# Altium schematic sheet Power_Switch.SchDoc: Ixora
size A3; Organization: Toradex AG; Address1: Altsagenstrasse 5; Address2: Horw; Address3: 6048; Address4: Switzerland; DocumentNumber: 4; Revision: V1.1; SheetNumber: 6; SheetTotal: 17; PageSetup: Record=PageOptions|CenterHorizontal=True|CenterVertical=True|PrintScale=0.71|XCorrection=1.00|YCorrection=1.00|PrintKind=0|BorderSize=5000000|LeftOffset=0|BottomOffset=0|Orientation=2|PaperLength=1000|PaperWidth=1000|Scale=100|PaperSource=7|PrintQuality=-4|MediaType=1|DitherType=10|PaperKind=A4|PrintScaleMode=1
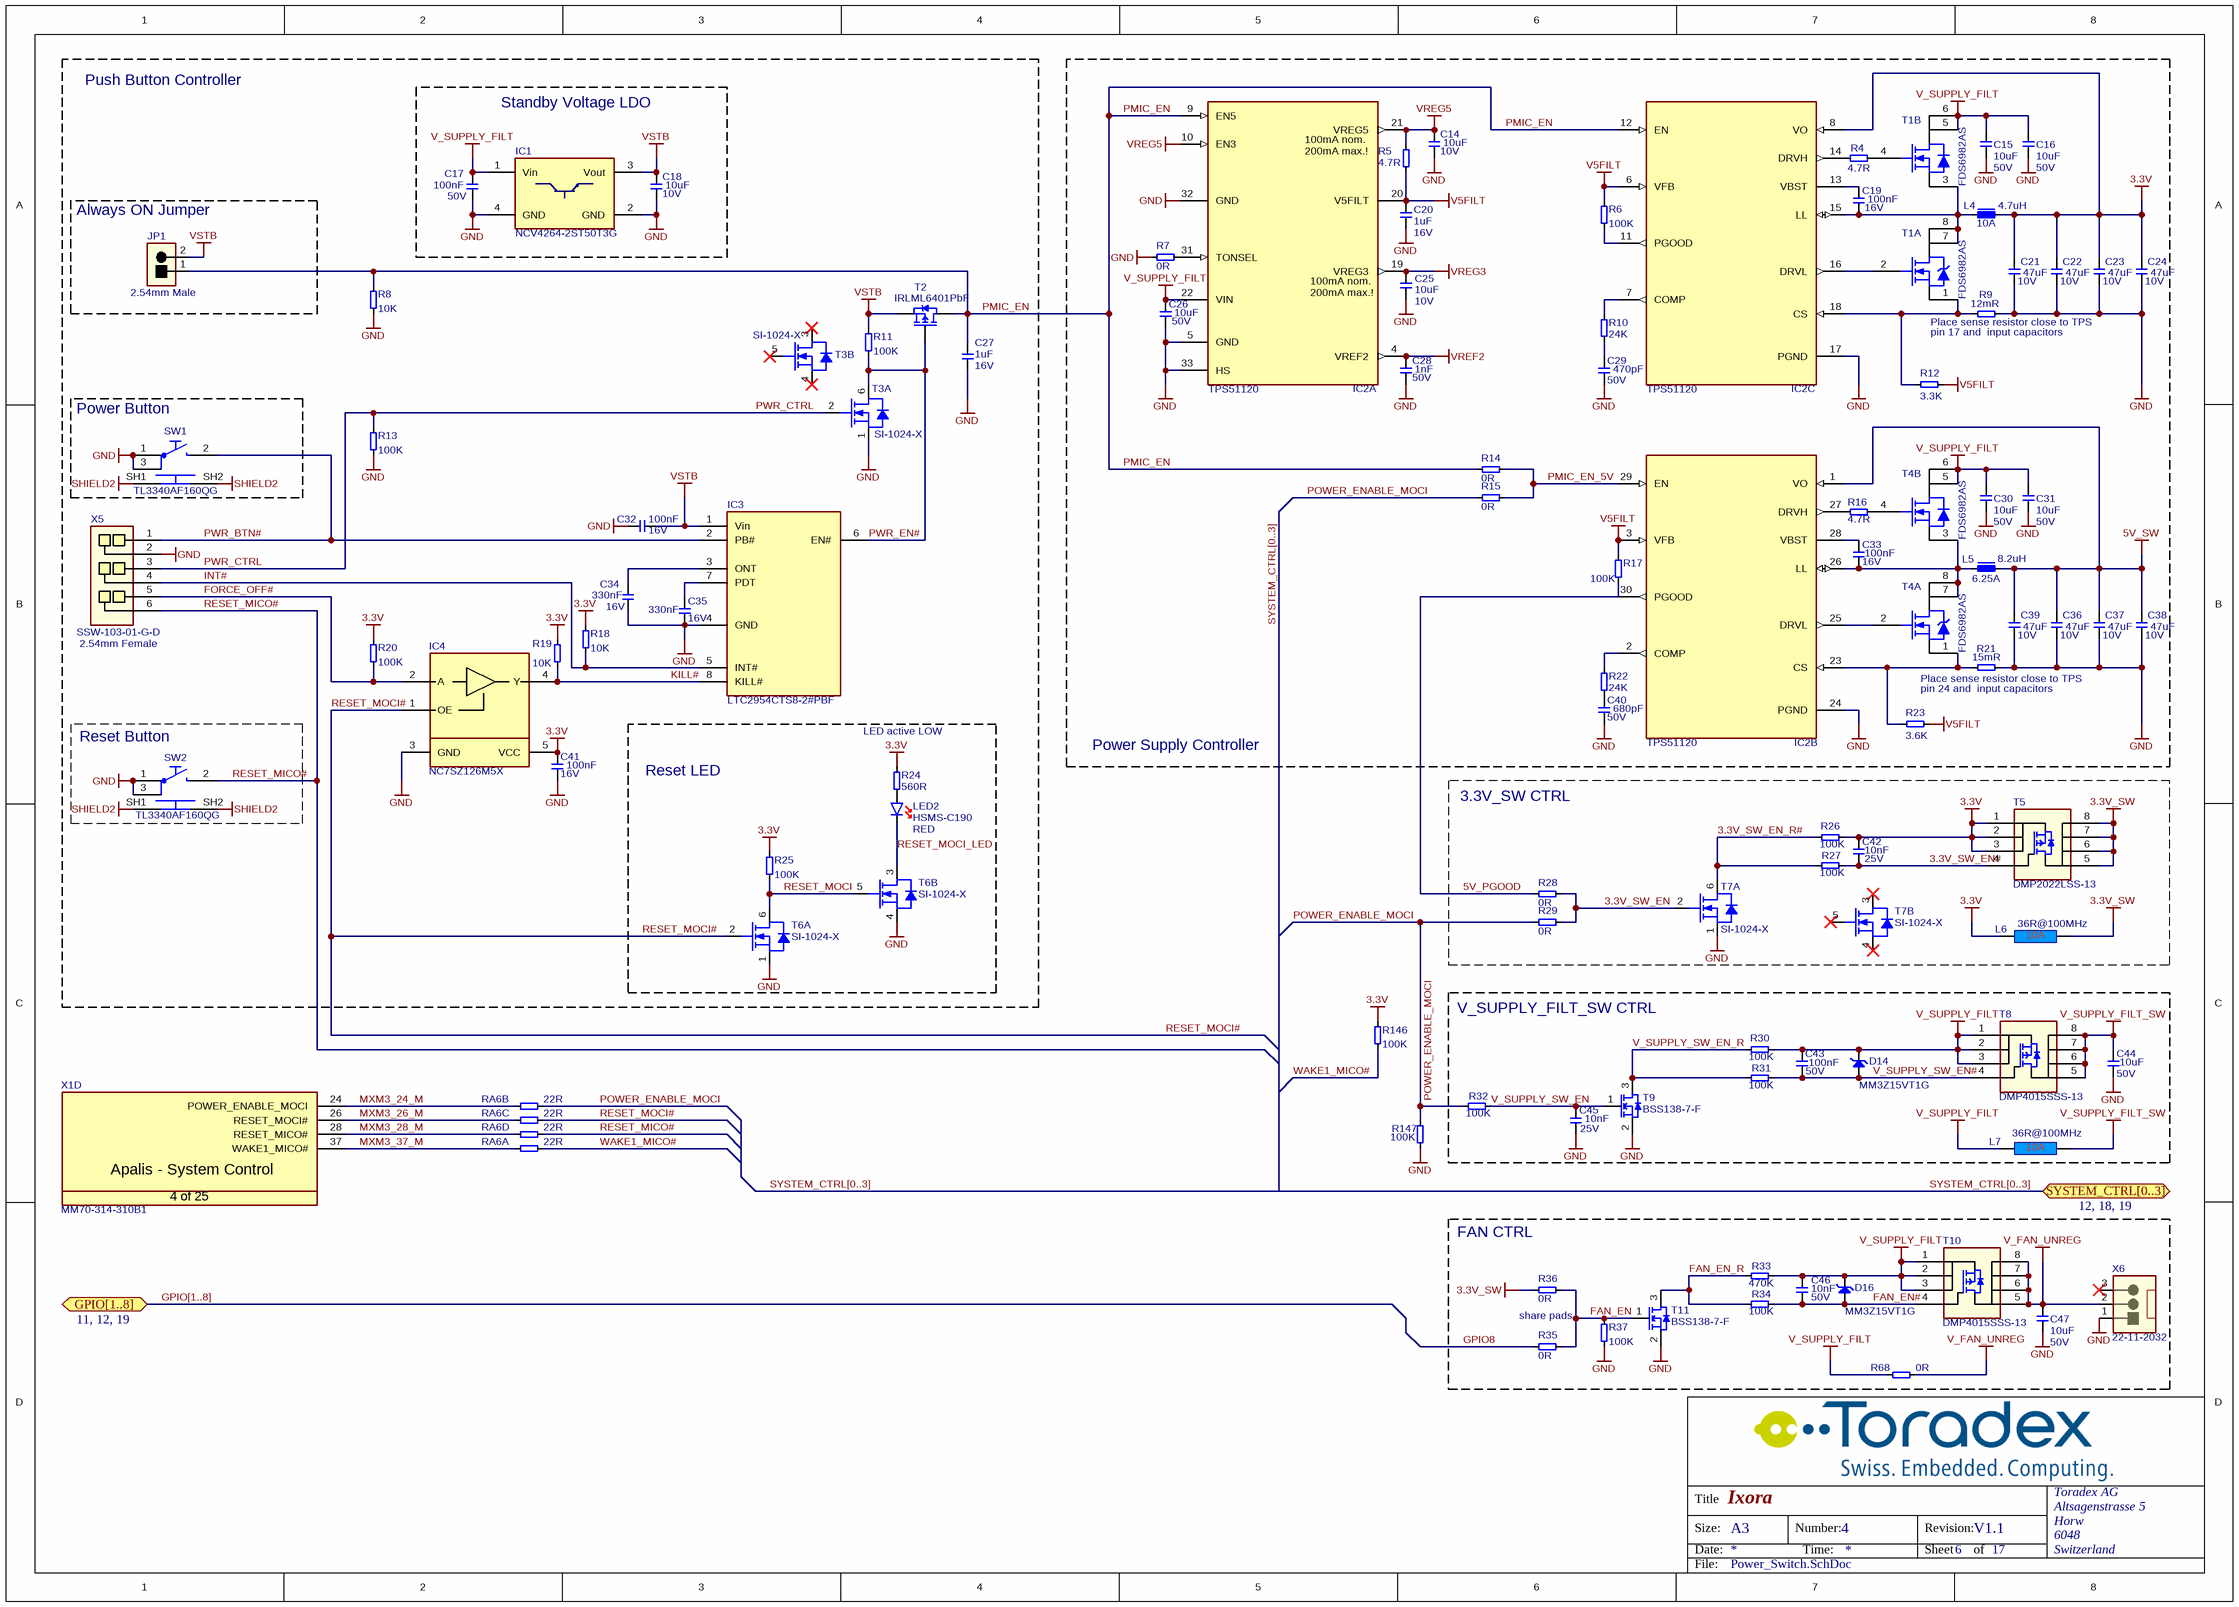
[diagram p0: Power_Switch.SchDoc]

## Parts
C14  Rating: 10V  [T_CAPC0603X33N]  (hidden comment: 10uF)
C15  Rating: 50V  [CAPC3225X160N]  (hidden comment: 10uF)
C16  Rating: 50V  [CAPC3225X160N]  (hidden comment: 10uF)
C17  Rating: 50V  [T_CAPC0603X33N]  (hidden comment: 100nF)
C18  Rating: 10V  [T_CAPC0603X33N]  (hidden comment: 10uF)
C19  Rating: 16V  [CAPC1005X60N]  (hidden comment: 100nF)
C20  Rating: 16V  [T_CAPC0603X33N]  (hidden comment: 1uF)
C21  Rating: 10V  [T_CAPC0805X125N]  (hidden comment: 47uF)
C22  Rating: 10V  [T_CAPC0805X125N]  (hidden comment: 47uF)
C23  Rating: 10V  [T_CAPC0805X125N]  (hidden comment: 47uF)
C24  Rating: 10V  [T_CAPC0805X125N]  (hidden comment: 47uF)
C25  Rating: 10V  [T_CAPC0603X33N]  (hidden comment: 10uF)
C26  Rating: 50V  [CAPC3225X160N]  (hidden comment: 10uF)
C27  Rating: 16V  [T_CAPC0603X33N]  (hidden comment: 1uF)
C28  Rating: 50V  [CAPC1005X60N]  (hidden comment: 1nF)
C29  Rating: 50V  [CAPC1005X60N]  (hidden comment: 470pF)
C30  Rating: 50V  [CAPC3225X160N]  (hidden comment: 10uF)
C31  Rating: 50V  [CAPC3225X160N]  (hidden comment: 10uF)
C32  Rating: 16V  [CAPC1005X60N]  (hidden comment: 100nF)
C33  Rating: 16V  [CAPC1005X60N]  (hidden comment: 100nF)
C34  Rating: 16V  [T_CAPC0805X125N]  (hidden comment: 330nF)
C35  Rating: 16V  [T_CAPC0805X125N]  (hidden comment: 330nF)
C36  Rating: 10V  [T_CAPC0805X125N]  (hidden comment: 47uF)
C37  Rating: 10V  [T_CAPC0805X125N]  (hidden comment: 47uF)
C38  Rating: 10V  [T_CAPC0805X125N]  (hidden comment: 47uF)
C39  Rating: 10V  [T_CAPC0805X125N]  (hidden comment: 47uF)
C40  Rating: 50V  [CAPC1005X60N]  (hidden comment: 680pF)
C41  Rating: 16V  [CAPC1005X60N]  (hidden comment: 100nF)
C42  Rating: 25V  [CAPC1005X60N]  (hidden comment: 10nF)
C43  Rating: 50V  [T_CAPC0603X33N]  (hidden comment: 100nF)
C44  Rating: 50V  [CAPC3225X160N]  (hidden comment: 10uF)
C45  Rating: 25V  [CAPC1005X60N]  (hidden comment: 10nF)
C46  Rating: 50V  [CAPC1005X60N]  (hidden comment: 10nF)
C47  Rating: 50V  [CAPC3225X160N]  (hidden comment: 10uF)
D14  MM3Z15VT1G  [T_SOD-323]
D16  MM3Z15VT1G  [T_SOD-323]
IC1  NCV4264-2ST50T3G  [T_ON_NCV4264-2ST50T3G]
IC2  TPS51120  [QFN50P500X500X100-33N]  (parts A,B,C of 3)
IC3  LTC2954CTS8-2#PBF  [T_LINEAR_LTC2954CTS8-2#PBF]
IC4  NC7SZ126M5X  [SOT95P279X142-5N]
JP1  TSW-101-07-G-D  [T_Samtec_TSW-101-07-G-D]  (value not drawn)
L4  Rating: 10A  [T_INDM110100]  (hidden comment: 4.7uH)
L5  Rating: 6.25A  [T_INDM120120X80N]  (hidden comment: 8.2uH)
L6  36R@100MHz  [T_Laird_35F0121-0SR-10]
L7  36R@100MHz  [T_Laird_35F0121-0SR-10]
LED2  Manufacturer Part No.: HSMS-C190  Color: RED  [LEDC1608X80N_R]  (hidden comment: LED)
R4  4.7R  [RESC1005X40N]
R5  4.7R  [RESC1005X40N]
R6  100K  [RESC1005X40N]
R7  0R  [RESC1005X40N]
R8  10K  [RESC1005X40N]
R9  12mR  [RESC3316X76N]
R10  24K  [RESC1005X40N]
R11  100K  [RESC1005X40N]
R12  3.3K  [RESC1005X40N]
R13  100K  [RESC1005X40N]
R14  0R  [T_RESC0603X30N]
R15  0R  [T_RESC0603X30N]
R16  4.7R  [RESC1005X40N]
R17  100K  [RESC1005X40N]
R18  10K  [RESC1005X40N]
R19  10K  [RESC1005X40N]
R20  100K  [RESC1005X40N]
R21  15mR  [RESC3316X76N]
R22  24K  [RESC1005X40N]
R23  3.6K  [RESC1005X40N]
R24  560R  [RESC1005X40N]
R25  100K  [RESC1005X40N]
R26  100K  [RESC1005X40N]
R27  100K  [RESC1005X40N]
R28  0R  [T_RESC0603X30N]
R29  0R  [T_RESC0603X30N]
R30  100K  [RESC1005X40N]
R31  100K  [RESC1005X40N]
R32  100K  [RESC1005X40N]
R33  470K  [RESC1005X40N]
R34  100K  [RESC1005X40N]
R35  0R  [T_RESC0603X30N]
R36  0R  [T_RESC0603X30N]
R37  100K  [RESC1005X40N]
R68  0R  [T_RESC3225X30N]
R146  100K  [RESC1005X40N]
R147  100K  [RESC1005X40N]
RA6  22R  [T_Resistor_Array_X4]  (parts A,B,C,D of 4)
SW1  TL3340AF160QG  [T_E-SWITCH- TL3340AF160QG]
SW2  TL3340AF160QG  [T_E-SWITCH- TL3340AF160QG]
T1  FDS6982AS  [SOIC127P600X173-8N]  (parts A,B of 2)
T2  IRLML6401PbF  [SOT95P237X112-3N]
T3  Manufacturer Part No.: SI-1024-X  [SOTFL50P160X60-6N]  (hidden comment: T-Vishay-SI-1024X-N)  (parts A,B of 2)
T4  FDS6982AS  [SOIC127P600X173-8N]  (parts A,B of 2)
T5  DMP2022LSS-13  [SOIC127P600X173-8N]
T6  Manufacturer Part No.: SI-1024-X  [SOTFL50P160X60-6N]  (hidden comment: T-Vishay-SI-1024X-N)  (parts A,B of 2)
T7  Manufacturer Part No.: SI-1024-X  [SOTFL50P160X60-6N]  (hidden comment: T-Vishay-SI-1024X-N)  (parts A,B of 2)
T8  DMP4015SSS-13  [SOIC127P600X173-8N]
T9  BSS138-7-F  [SOT95P237X112-3N]
T10  DMP4015SSS-13  [SOIC127P600X173-8N]
T11  BSS138-7-F  [SOT95P237X112-3N]
X1  Manufacturer Part No.: MM70-314-310B1  [T_JAE_MM70-314-310B1]  (hidden comment: CON-JAE-MM70-314-310B1-314-0.5mm)  (part D of 25)
X5  Manufacturer Part No.: SSW-103-01-G-D  [T_Samtec_SSW-103-01-G-D]  (hidden comment: TSW-103-01-G-D)
X6  22-11-2032  [T_MOLEX_22-11-2032]

## Blocks framed on the sheet
Push Button Controller: C27 C32 C34 C35 C41 IC3 IC4 R8 R11 R13 R18-R20 T2 T3 X5
Power Supply Controller: C14-C16 C19-C26 C28-C31 C33 C36-C40 IC2 L4 L5 R4-R7 R9 R10 R12 R14-R17 R21-R23 T1 T4
Standby Voltage LDO: C17 C18 IC1
Always ON Jumper: JP1
Power Button: SW1
Reset Button: SW2
Reset LED: LED2 R24 R25 T6
3.3V_SW CTRL: C42 L6 R26-R29 T5 T7
V_SUPPLY_FILT_SW CTRL: C43-C45 D14 L7 R30-R32 T8 T9
FAN CTRL: C46 C47 D16 R33-R37 R68 T10 T11 X6

## Ports
GPIO[1..8] (bidir, see 11, 12, 19), SYSTEM_CTRL[0..3] (bidir, see 12, 18, 19)

## Nets
3.3V: C21.2 C22.2 C23.2 C24.2 C41.1 C42.2 IC2.8(VO) IC4.5(VCC) L4.2 L6.1 R18.1 R19.1 R20.2 R24.1 R25.2 R26.1 R146.2 T5.1(S) T5.2(S) T5.3(S)
3.3V_SW: L6.2 R36.1 T5.5(D) T5.6(D) T5.7(D) T5.8(D)
5V_SW: C36.2 C37.2 C38.2 C39.2 IC2.1(VO) L5.2
GND: C14.1 C15.1 C16.1 C17.1 C18.1 C20.1 C21.1 C22.1 C23.1 C24.1 C25.1 C26.1 C27.1 C28.1 C29.1 C30.1 C31.1 C32.1 C34.1 C35.1 C36.1 C37.1 C38.1 C39.1 C40.1 C41.2 C44.1 C45.1 C47.1 IC1.2(GND) IC1.4(GND) IC2.5(GND) IC2.17(PGND) IC2.24(PGND) IC2.32(GND) IC2.33(HS) IC3.4(GND) IC4.3(GND) R7.1 R8.1 R9.2 R13.1 R21.2 R37.2 R147.1 SW1.1 SW1.3 SW2.1 SW2.3 T3.1(S) T6.1(S) T6.4(S) T7.1(S) T9.2 T11.2 X5.2 X6.1
SHIELD2: SW1.SH1 SW1.SH2 SW2.SH1 SW2.SH2
V5FILT: C20.2 IC2.3(VFB) IC2.6(VFB) IC2.20(V5FILT) R5.1 R6.2 R12.2 R17.2 R23.2
V_FAN_UNREG: C47.2 R68.2 T10.5(D) T10.6(D) T10.7(D) T10.8(D) X6.2
V_SUPPLY_FILT: C15.2 C16.2 C17.2 C26.2 C30.2 C31.2 C43.2 C46.2 D14.1(C) D16.1(C) IC1.1(Vin) IC2.22(VIN) L7.1 R30.2 R33.2 R68.1 T1.5(D) T1.6(D) T4.5(D) T4.6(D) T8.1(S) T8.2(S) T8.3(S) T10.1(S) T10.2(S) T10.3(S)
V_SUPPLY_FILT_SW: C44.2 L7.2 T8.5(D) T8.6(D) T8.7(D) T8.8(D)
VREF2: C28.2 IC2.4(VREF2)
VREG3: C25.2 IC2.19(VREG3)
VREG5: C14.2 IC2.10(EN3) IC2.21(VREG5) R5.2
VSTB: C18.2 C32.2 IC1.3(Vout) IC3.1(Vin) JP1.2 R11.2 T2.2
3.3V_SW_EN: R28.1 R29.2 T7.2(G)
3.3V_SW_EN#: C42.1 R27.1 T5.4(G)
3.3V_SW_EN_R#: R26.2 R27.2 T7.6(D)
5V_PGOOD: IC2.30(PGOOD) R17.1 R28.2
FAN_EN: R35.1 R36.2 R37.1 T11.1
FAN_EN#: C46.1 D16.2(A) R34.2 T10.4(G)
FAN_EN_R: R33.1 R34.1 T11.3
FORCE_OFF#: IC4.2(A) R20.1 X5.5
GPIO8: R35.2
INT#: IC3.5(INT#) R18.2 X5.4
KILL#: IC3.8(KILL#) IC4.4(Y) R19.2
MXM3_24_M: RA6.2 X1.24(POWER_ENABLE_MOCI)
MXM3_26_M: RA6.3 X1.26(RESET_MOCI#)
MXM3_28_M: RA6.4 X1.28(RESET_MICO#)
MXM3_37_M: RA6.1 X1.37(WAKE1_MICO#)
PMIC_EN: C27.2 IC2.9(EN5) IC2.12(EN) JP1.1 R8.2 R14.1 T2.3
PMIC_EN_5V: IC2.29(EN) R14.2 R15.2
POWER_ENABLE_MOCI: R15.1 R29.1 R32.1 R147.2 RA6.6
PWR_BTN#: IC3.2(PB#) SW1.2 X5.1
PWR_CTRL: R13.2 T3.2(G) X5.3
PWR_EN#: IC3.6(EN#) R11.1 T2.1 T3.6(D)
RESET_MICO#: RA6.8 SW2.2 X5.6
RESET_MOCI: R25.1 T6.5(G) T6.6(D)
RESET_MOCI#: IC4.1(OE) RA6.7 T6.2(G)
RESET_MOCI_LED: LED2.1(K) T6.3(D)
V_SUPPLY_SW_EN: C45.2 R32.2 T9.1
V_SUPPLY_SW_EN#: C43.1 D14.2(A) R31.2 T8.4(G)
V_SUPPLY_SW_EN_R: R30.1 R31.1 T9.3
WAKE1_MICO#: R146.1 RA6.5
NetC19_1: C19.1 IC2.15(LL) L4.1 T1.3(S) T1.7(D) T1.8(D)
NetC19_2: C19.2 IC2.13(VBST)
NetC29_2: C29.2 R10.1
NetC33_1: C33.1 IC2.26(LL) L5.1 T4.3(S) T4.7(D) T4.8(D)
NetC33_2: C33.2 IC2.28(VBST)
NetC34_2: C34.2 IC3.3(ONT)
NetC35_2: C35.2 IC3.7(PDT)
NetC40_2: C40.2 R22.1
NetIC2_2: IC2.2(COMP) R22.2
NetIC2_7: IC2.7(COMP) R10.2
NetIC2_11: IC2.11(PGOOD) R6.1
NetIC2_14: IC2.14(DRVH) R4.1
NetIC2_16: IC2.16(DRVL) T1.2(G)
NetIC2_18: IC2.18(CS) R9.1 R12.1 T1.1(S)
NetIC2_23: IC2.23(CS) R21.1 R23.1 T4.1(S)
NetIC2_25: IC2.25(DRVL) T4.2(G)
NetIC2_27: IC2.27(DRVH) R16.1
NetIC2_31: IC2.31(TONSEL) R7.2
NetLED2_2: LED2.2(A) R24.2
NetR4_2: R4.2 T1.4(G)
NetR16_2: R16.2 T4.4(G)

Not connected (* = marked no-connect by the designer): T3 3(D)* 4(S)* 5(G)*; T7 3(D)* 4(S)* 5(G)*; X6 3*

## Buses and harness runs
bus GPIO[1..8] = port GPIO[1..8]
bus SYSTEM_CTRL[0..3] = port SYSTEM_CTRL[0..3]

## Notes on the sheet
- (near JP1) 2.54mm Male
- (near R9) Place sense resistor close to TPS
- (near R9) pin 17 and  input capacitors
- (near X5) 2.54mm Female
- (near R21) Place sense resistor close to TPS
- pin 24 and  input capacitors
- LED active LOW
- share pads
- Title
- Size:
- Date:
- A3
- Number:
- Time:
- Revision:
- Sheet
- of
- File:
- (in symbol CON-JAE-MM70-314-310B1-314-0.5mm, part D) Apalis - System Control; 4 of 25
- (in symbol IC-TI-TPS51120, part A) 100mA nom.; 200mA max.!

## Library data of the parts
C14 C18 C25 = C-X5R-10uF-10V-20%-0603: Capacitor Ceramic X5R 10uF 10V 20% 0603; Tolerance: 20%; Type: X5R; Value: 10uF
C15 C16 C26 C30 C31 C44 C47 = C-X5R-10uF-50V-20%-1210: Capacitor Ceramic X5R 10uF 50V 20% 1210; Tolerance: 20%; Type: X5R; Value: 10uF
C17 C43 = C-X7R-100nF-50V-20%-0603: Capacitor Ceramic X7R 100nF 50V 20% 0603; Tolerance: 20%; Type: X7R; Value: 100nF
C19 C32 C33 C41 = C-X7R-100nF-16V-10%-0402: Capacitor Ceramic X7R 100nF 16V 10% 0402; Tolerance: 10%; Type: X7R; Value: 100nF
C20 C27 = C-X5R-1uF-16V-20%-0603: Capacitor Ceramic X5R 1uF 16V 20% 0603; Tolerance: 20%; Type: X5R; Value: 1uF
C21-C24 C36-C39 = C-X5R-47uF-10V-20%-0805: Capacitor Ceramic X5R 47uF 10V 20% 0805; Tolerance: 20%; Type: X5R; Value: 47uF
C28 = C-X7R-1nF-50V-10%-0402: Capacitor Ceramic X7R 1nF 50V 10% 0402; Tolerance: 10%; Type: X7R; Value: 1nF
C29 = C-X7R-470pF-50V-10%-0402: Capacitor Ceramic X7R 470pF 50V 10% 0402; Tolerance: 10%; Type: X7R; Value: 470pF
C34 C35 = C-X7R-330nF-16V-10%-0805: Capacitor Ceramic X7R 330nF 16V 10% 0805; Tolerance: 10%; Type: X7R; Value: 330nF
C40 = C-X7R-680pF-50V-10%-0402: Capacitor Ceramic X7R 680pF 50V 10% 0402; Tolerance: 10%; Type: X7R; Value: 680pF
C42 C45 = C-X7R-10nF-25V-10%-0402: Capacitor Ceramic X7R 10nF 25V 10% 0402; Tolerance: 10%; Type: X7R; Value: 10nF
C46 = C-X7R-10nF-50V-10%-0402: Capacitor Ceramic X7R 10nF 50V 10% 0402; Tolerance: 10%; Type: X7R; Value: 10nF
D14 D16 = D-OnSemi-MM3Z15VT1G: Zener Diode, Vz=15V, 300mW, SOD-323; Manufacturer Name: OnSemi; Manufacturer Part No.: MM3Z15VT1G
IC1 = IC-ON-NCV4264-2ST50T3G: NCV4264-2ST50T3G LDO Regulator; Manufacturer Name: ON Semiconductor; Manufacturer Part No.: NCV4264-2ST50T3G
IC2 = IC-TI-TPS51120: Power Supply Controller; Manufacturer Name: Texas Instruments; Manufacturer Part No.: TPS51120
IC3 = IC-LIN-LTC2954CTS8-2#PBF: Push Button On/Off Controller; Manufacturer Name: Linear; Manufacturer Part No.: LTC2954CTS8-2#PBF
IC4 = IC-FAR-NC7SZ126M5X: NC7SZ126M5X  Buffer Three-State Output; Manufacturer Name: Fairchild Semiconductor; Manufacturer Part No.: NC7SZ126M5X
JP1 = CON-Samtec-TSW-101-07-G-D: Header male, 1x2 Pins, 2.54 mm pitch; Manufacturer Name: Samtec; Pitch: 2.54 mm; No. of ways: 1x2; Manufacturer Part no.: TSW-101-07-G-D
L4 = L-Bourns-SRP1038A-4R7M: Inductance 4.7uH 10A 20% 15.5 mOhm -40°C to125°C; Manufacturer Name: Bourns; Tolerance: 20%; Manufacturer Part No.: SRP1038A-4R7M; Value: 4.7uH; DC Resistance: 15.5 mOhm
L5 = L-Wurth-744771008-8.2uH-6.25A-20%: Inductance 8.2uH 6.25A 20%; Manufacturer Name: Wurth; Tolerance: 20%; Manufacturer Part No.: 744771008; Value: 8.2uH
L6 L7 = L-Laird-35F0121-0SR-10-10A-25%: Power Supply FB 10A; Tolerance: 25%; Rating: 10A; Value: 36R@100MHz
LED2 = LED-Avago-HSMS-C190: Surface mount LED red 20mA; Manufacturer Name: Avago
R4 R5 R16 = R-4.7R-63mW-5%-0402: Resistor 4.7 ohm 63mW 5% 0402; Rating: 63mW; Tolerance: 5%; Value: 4.7R
R6 R11 R13 R17 R20 R25-R27 R30-R32 R34 R37 R146 R147 = R-100KR-63mW-5%-0402: Resistor 100 Kohm 63mW 5% 0402; Value: 100KR; Rating: 63mW; Tolerance: 5%
R7 = R-0R-63mW-1%-0402: Resistor 0 ohm 63mW 1% 0402; Rating: 63mW; Tolerance: 1%; Value: 0R
R8 R18 R19 = R-10KR-63mW-5%-0402: Resistor 10 Kohm 63mW 5% 0402; Value: 10KR; Rating: 63mW; Tolerance: 5%
R9 = R-12mR-250mW-1%-1206: Resistor 12 mohm 250mW 1% 1206; Rating: 250mW; Tolerance: 1%; Value: 12mR
R10 R22 = R-24KR-63mW-1%-0402: Resistor 24 Kohm 63mW 1% 0402; Value: 24KR; Rating: 63mW; Tolerance: 1%
R12 = R-3.3KR-63mW-1%-0402: Resistor 3.3 Kohm 63mW 1% 0402; Value: 3.3KR; Rating: 63mW; Tolerance: 1%
R14 R15 R28 R29 R35 R36 = R-0R-63mW-1%-0603: Resistor 0 ohm 63mW 1% 0603; Rating: 63mW; Tolerance: 1%; Value: 0R
R21 = R-15mR-250mW-1%-1206: Resistor 15 mohm 250mW 1% 1206; Rating: 250mW; Tolerance: 1%; Value: 15mR
R23 = R-3.6KR-63mW-1%-0402: Resistor 3.6 Kohm 63mW 1% 0402; Value: 3.6KR; Rating: 63mW; Tolerance: 1%
R24 = R-560R-63mW-5%-0402: Resistor 560 ohm 63mW 5% 0402; Rating: 63mW; Tolerance: 5%; Value: 560R
R33 = R-470KR-63mW-5%-0402: Resistor 470 Kohm 63mW 5% 0402; Value: 470KR; Rating: 63mW; Tolerance: 5%
R68 = R-0R-63mW-1%-1210: Resistor 0 ohm 63mW 1% 1210; Rating: 63mW; Tolerance: 1%; Value: 0R
RA6 = RA-22R-63mW-5%-1206-div: Resistor Array 22 R 63mW 5% 1206; Tolerance: 5%; Power Dissipation: 63mW; Value: 22R
SW1 SW2 = SW-E-Switch-TL3340AF160QG: SWITCH TACT SUB MINI 160GF SMD Right Angle; Manufacturer Part No.: TL3340AF160QG; Manufacturer Name: E-Switch
T1 T4 = T-Fairchild-FDS6982AS-N: N-Channel PowerTrench SyncFET; Manufacturer Name: Fairchild; Manufacturer Part No.: FDS6982AS
T2 = T-IR-IRLML6401PbF-SOT-23: p-channel MOSFET, IRLML6401PbF; Manufacturer Name: International Rectifier; Manufacturer Part No.: IRLML6401PbF
T3 T6 T7 = T-Vishay-SI-1024X-N: Dual N-Channel 20V (D-S)  MOSFET; Manufacturer Name: Vishay
T5 = T-Diodes-DMP2022LSS-13-8-SOIC: p-channel MOSFET, DMP2022LSS-13; Manufacturer Name: DIODES; Manufacturer Part No.: DMP2022LSS-13
T8 T10 = T-DiodesInc-DMP4015SSS-13: P-channel MOSFET, DMP4015SSS-13; Manufacturer Name: Diodes Inc; Manufacturer Part No.: DMP4015SSS-13
T9 T11 = T-Diodes-BSS138-7-F: N-channel MOSFET, BSS138-7-F; Manufacturer Name: Diodes; Manufacturer Part No.: BSS138-7-F
X1 = CON-JAE-MM70-314-310B1-314-0.5mm: MXM3 Connector; Manufacturer Name: JAE; No. of ways: 314
X5 = CON-Samtec-SSW-103-01-G-D: Receptacle Female Socket, 2x3 Pins, 2.54mm pitch; Manufacturer Name: Samtec; No. of ways: 2x3; Pitch: 2.54mm
X6 = CON-Molex-22-11-2032: Header with Friction Lock; Manufacturer Name: Molex; No. of ways: 3; Manufacturer Part No.: 22-11-2032